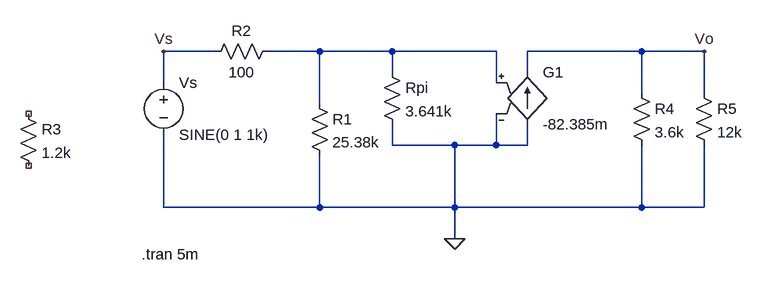
[diagram p0: schematic Lab4.g.asc]
Lab4.g.asc, the LTspice schematic file:
Version 4
SHEET 1 880 680
WIRE -256 80 -336 80
WIRE -96 80 -176 80
WIRE 16 80 -96 80
WIRE 176 80 16 80
WIRE 400 80 224 80
WIRE 496 80 400 80
WIRE 16 112 16 80
WIRE 224 112 224 80
WIRE -336 128 -336 80
WIRE 176 128 176 80
WIRE 400 144 400 80
WIRE 496 144 496 80
WIRE -96 160 -96 80
WIRE 16 224 16 192
WIRE 112 224 16 224
WIRE 176 224 176 176
WIRE 176 224 112 224
WIRE 224 224 224 192
WIRE 224 224 176 224
WIRE -336 320 -336 208
WIRE -96 320 -96 240
WIRE -96 320 -336 320
WIRE 112 320 112 224
WIRE 112 320 -96 320
WIRE 400 320 400 224
WIRE 400 320 112 320
WIRE 496 320 496 224
WIRE 496 320 400 320
WIRE 112 368 112 320
FLAG 112 368 0
FLAG 496 80 Vo
FLAG -336 80 Vs
SYMBOL res 0 96 R0
SYMATTR InstName Rpi
SYMATTR Value 3.641k
SYMBOL g 224 96 R0
SYMATTR InstName G1
SYMATTR Value -82.385m
SYMBOL res -272 96 R270
WINDOW 0 32 56 VTop 2
WINDOW 3 0 56 VBottom 2
SYMATTR InstName R2
SYMATTR Value 100
SYMBOL voltage -336 112 R0
WINDOW 123 0 0 Left 0
WINDOW 39 0 0 Left 0
SYMATTR InstName Vs
SYMATTR Value SINE(0 1 1k)
SYMBOL res 384 128 R0
SYMATTR InstName R4
SYMATTR Value 3.6k
SYMBOL res 480 128 R0
SYMATTR InstName R5
SYMATTR Value 12k
SYMBOL res -112 144 R0
SYMATTR InstName R1
SYMATTR Value 25.38k
SYMBOL res -560 160 R0
SYMATTR InstName R3
SYMATTR Value 1.2k
TEXT -370 392 Left 2 !.tran 5m

The netlist it stands for:
* Lab4.g.asc
Rpi N001 0 3.641k
G1 0 Vo N001 0 -82.385m
R2 Vs N001 100
Vs Vs 0 SINE(0 1 1k)
R4 Vo 0 3.6k
R5 Vo 0 12k
R1 N001 0 25.38k
R3 NC_01 NC_02 1.2k
.tran 5m
.backanno
.end